# Altium schematic sheet POWER.SchDoc: POWER
size 420 x 297 mm; DrawnBy: Hung Vo; SheetNumber: 4; SheetTotal: 4; MasterProject: BTL TKHTN
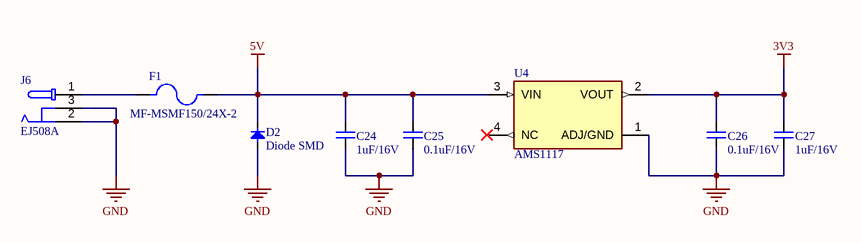
[diagram p0: POWER.SchDoc]

## Parts
C24  1uF/16V  [CAP_C_1608X80]
C25  0.1uF/16V  [CAP_C_1608X80]
C26  0.1uF/16V  [CAP_C_1608X80]
C27  1uF/16V  [CAP_C_1608X80]
D2  Diode SMD  [DO-214AC_SMA]
F1  MF-MSMF150/24X-2  [FUSER_MF-MSMF150/24X-2]
J6  EJ508A  [MPD_EJ508A]
U4  AMS1117  [SOT229P700X180-4N]

## Nets
3V3: C26.2 C27.2 U4.2(VOUT)
5V: C24.2 C25.2 D2.1(K) F1.2 U4.3(VIN)
GND: C24.1 C25.1 C26.1 C27.1 D2.2(A) J6.2 J6.3 U4.1(ADJ/GND)
NetF1_1: F1.1 J6.1

Not connected (* = marked no-connect by the designer): U4 4(NC)*

## Notes on the sheet
- Sub-system:
- Project:
- Design by:
- Sheet title:
- Sheet
- of
- Checked by:
- Approved by:
- Doc No:
- Revision:
- Size:
- Date:
- A3

## Library data of the parts
C24-C27 = CAP_SMD: CAP_Chip; Value: 33pF
D2 = Diode SMD: Default Diode; Code - JEDEC: DO-214-AB; Value: 1N5007; Published: 8-Jun-2000; Revision: July-2002: Re-released for DXP Platform.; Publisher: Altium Limited
F1 = MF-MSMF150/24X-2: Polymeric PTC Resettable Fuse 24V 1.5 A Ih Surface Mount 1812 (4532 Metric), Concave; MF: Bourns; Check_prices: https://www.snapeda.com/parts/MF-MSMF150/24X-2/Bourns/view-part/?ref=eda; Value: *; MP: MF-MSMF150/24X-2; Purchase-URL: https://pricing.snapeda.com/search/part/MF-MSMF150/24X-2/?ref=eda; SnapEDA_Link: https://www.snapeda.com/parts/MF-MSMF150/24X-2/Bourns/view-part/?ref=snap; Package: 1812 Bourns; Digi-Key_Part_Number: MF-MSMF150/24X-2TR-ND
J6 = EJ508A: Power Barrel Connector Jack 2.10mm ID _0.083_, 5.50mm OD _0.217_ Through Hole, Right Angle; MF: MPD; Package: Non-Standard MPD; Value: *; SnapEDA_Link: https://www.snapeda.com/parts/EJ508A/MPD%20%28Memory%20Protection%20Devices%29/view-part/474399/?ref=snap; Price: None; MP: EJ508A; Availability: Unavailable
U4 = AMS1117: 1A LOW DROPOUT VOLTAGE REGULATOR SOT-223; MF: Advanced Monolithic Systems; SnapEDA_Link: https://www.snapeda.com/parts/AMS1117/Advanced+Monolithic+Systems/view-part/?ref=snap; Package: SOT-223 Seeed Technology; Value: *; MP: AMS1117; Check_prices: https://www.snapeda.com/parts/AMS1117/Advanced+Monolithic+Systems/view-part/?ref=eda